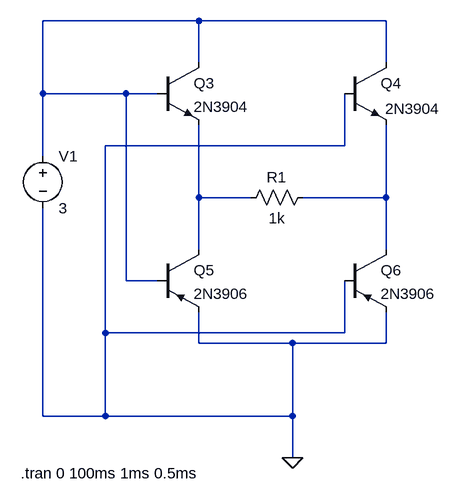
[diagram p0: schematic bjt_h_bridge.asc]
bjt_h_bridge.asc, the LTspice schematic file:
Version 4
SHEET 1 992 680
WIRE 368 -144 128 -144
WIRE 656 -144 368 -144
WIRE 368 -80 368 -144
WIRE 656 -80 656 -144
WIRE 128 -32 128 -144
WIRE 256 -32 128 -32
WIRE 304 -32 256 -32
WIRE 592 48 592 -32
WIRE 592 48 224 48
WIRE 128 64 128 -32
WIRE 368 128 368 16
WIRE 448 128 368 128
WIRE 656 128 656 16
WIRE 656 128 528 128
WIRE 368 208 368 128
WIRE 656 208 656 128
WIRE 256 256 256 -32
WIRE 304 256 256 256
WIRE 224 336 224 48
WIRE 592 336 592 256
WIRE 592 336 224 336
WIRE 368 352 368 304
WIRE 512 352 368 352
WIRE 656 352 656 304
WIRE 656 352 512 352
WIRE 128 464 128 144
WIRE 224 464 224 336
WIRE 224 464 128 464
WIRE 512 464 512 352
WIRE 512 464 224 464
WIRE 512 528 512 464
FLAG 512 528 0
SYMBOL npn 304 -80 R0
SYMATTR InstName Q3
SYMATTR Value 2N3904
SYMBOL npn 592 -80 R0
WINDOW 3 63 71 Left 2
SYMATTR InstName Q4
SYMATTR Value 2N3904
SYMBOL res 544 112 R90
WINDOW 0 0 56 VBottom 2
WINDOW 3 32 56 VTop 2
SYMATTR InstName R1
SYMATTR Value 1k
SYMBOL voltage 128 48 R0
WINDOW 123 0 0 Left 2
WINDOW 39 0 0 Left 2
SYMATTR InstName V1
SYMATTR Value 3
SYMBOL pnp 304 208 R0
SYMATTR InstName Q5
SYMATTR Value 2N3906
SYMBOL pnp 592 208 R0
SYMATTR InstName Q6
SYMATTR Value 2N3906
TEXT 94 552 Left 2 !.tran 0 100ms 1ms 0.5ms

The netlist it stands for:
* bjt_h_bridge.asc
Q3 N001 N001 N002 0 2N3904
Q4 N001 0 N003 0 2N3904
R1 N003 N002 1k
V1 N001 0 3
Q5 N002 N001 0 0 2N3906
Q6 N003 0 0 0 2N3906
.model NPN NPN
.model PNP PNP
.lib standard.bjt
.tran 0 100ms 1ms 0.5ms
.backanno
.end